# EAGLE design lm3410-sepic-led-driver-16mm-mk-4 (EAGLE 6.5.0)
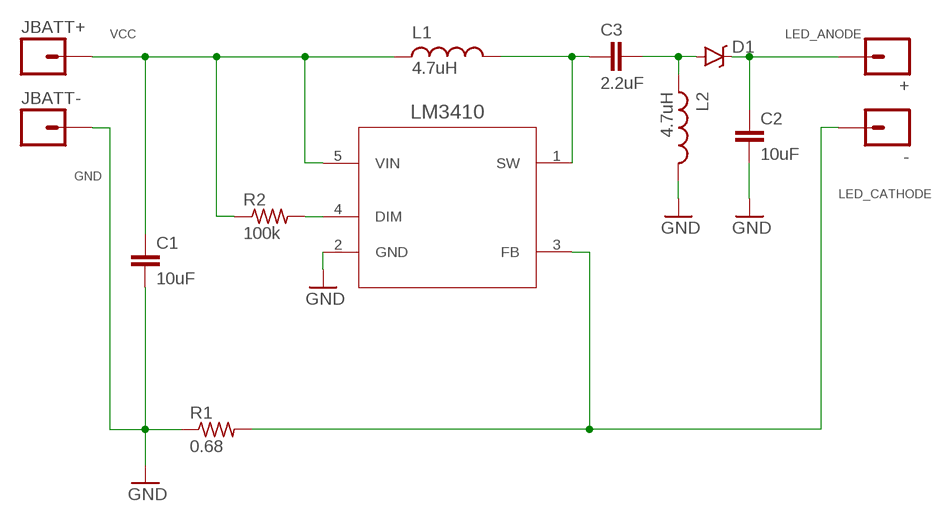
[diagram p0: schematic, sheet 1]

## Parts
+  M01PTH-1.2MM  [1X01-1.2MM]
-  M01PTH-1.2MM-NS  [1X01-1.2MM-NS]
C1  10uF  CAPACITOR-CERAMICC0603  [C0603]
C2  10uF  CAPACITOR-CERAMICC0603  [C0603]
C3  2.2uF  CAPACITOR-CERAMICC0805  [C0805]
D1  MBRA140  DIODE-SCHOTTKYMBRA140  [SMA-DIODE]
JBATT+  M01NOT-A-VIA-NOPE  [1X01_NOSILK_NOSTOP]
JBATT-  M01NOT-A-VIA-NOPE  [1X01_NOSILK_NOSTOP]
L1  4.7uH  INDUCTORTAIYO-YUDEN-30XX  [TAIYO-YUDEN-30XX]
L2  4.7uH  INDUCTORTAIYO-YUDEN-30XX  [TAIYO-YUDEN-30XX]
LM3410  LM3410XMF  [SOT95P285X120-5N]
R1  0.68  RESISTORR1206  [R1206]
R2  100k  RESISTORR0603  [R0603]

## Nets
GND: C1.2 C2.2 JBATT-.P$1 L2.2 LM3410.2(GND) R1.1
LED_ANODE: +.P$1 C2.1 D1.C
LED_CATHODE: -.P$1 LM3410.3(FB) R1.2
N$1: C3.2 D1.A L2.1
N$3: LM3410.4(DIM) R2.2
SW: C3.1 L1.2 LM3410.1(SW)
VCC: C1.1 JBATT+.P$1 L1.1 LM3410.5(VIN) R2.1

## Library data of the parts
+ - JBATT+ JBATT- = A_butts:M01: Header 1 Standard 1-pin 0.1" header. Use with straight break away headers (SKU : PRT-00116), right angle break away headers (PRT-00553), swiss pins (PRT-00743), machine pins (PRT-00117), and female headers (PRT-00115).
C1-C3 = A_butts:CAPACITOR-CERAMIC: CAPACITOR, European symbol
D1 = A_butts:DIODE-SCHOTTKY: Schottky diodes in SFE's production catalog BAT20J 1A 23V 0.62Vf RB751 120mA 40V 0.37Vf PMEG4005EJ 0.5A 40V 0.42Vf MBRA140 1A 40V 0.5Vf B340A 3A 40V SMA; PROD_ID: DIO-08053
L1 L2 = A_butts:INDUCTOR: Inductors Basic Inductor/Choke - 0603 and 1206. Footprints are not proven and vary greatly between part numbers. SRN6045- 33uH, 20% 1.4A SDR0403-560KL - 56uH, 10%, 500mA RMS/740mA peak
LM3410 = A_butts:LM3410XMF: Constant Current Boost and SEPIC LED Driver; MPN: LM3410XMF; OC_FARNELL: 1685357; OC_NEWARK: 75M6032; PACKAGE: SOT-5; SUPPLIER: National Semiconductor
R1 R2 = A_butts:RESISTOR: RESISTOR, American symbol

## Board
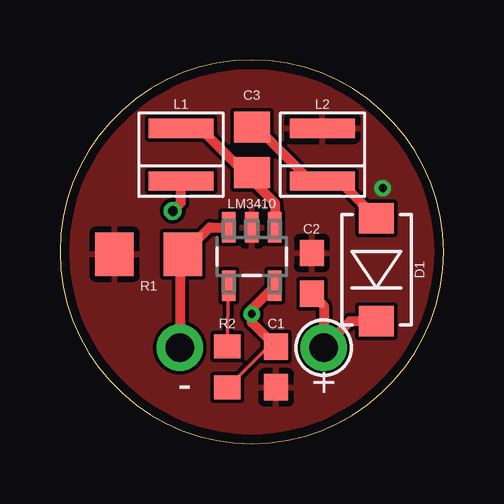
[diagram p1: board, top side]
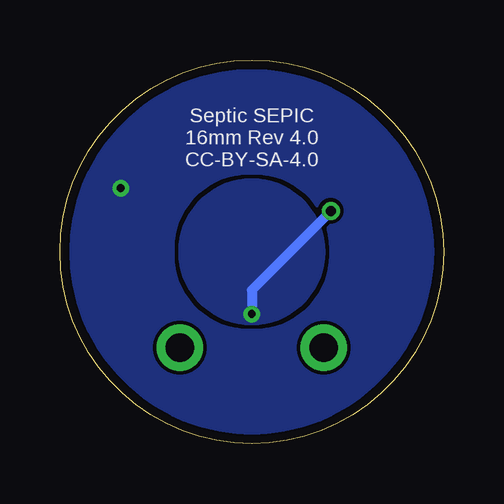
[diagram p2: board, bottom side, seen from below]

Size 16 x 16 mm. Coordinates in mm from the lower left corner, seen from the top.
Outline: 0,8 arc90 8,0 arc90 16,8 arc90 8,16 arc90 0,8
Copper layers (1*16): Top 0.0356mm / dielectric 1.5011mm / Bottom 0.0356mm
Design rules "LaenPCBOrder2": minimum track width 6mil, minimum drill 13mil, track to track 6mil, track to pad 6mil, pad to pad 6mil, via to via 6mil, smd to smd 6mil, copper to edge 15mil, drill to drill 6mil, minimum pad ring 7mil, minimum via ring 7mil, stop-mask expansion 3mil, vias tented up to drill 20mil, thermal gap 10mil

### Footprints (pad centres in the part's own frame; a part is rotated, then mirrored left to right if it is on the bottom)
1X01-1.2MM = drill 1.2 pad 1.93: P$1 0,0
1X01-1.2MM-NS = drill 1.2 pad 1.93: P$1 0,0
C0603 = smd 1.1 x 1: 1 -0.85,0; 2 0.85,0
C0805 = smd 1.3 x 1.5: 1 -0.95,0; 2 0.95,0
SMA-DIODE = smd 1.27 x 1.47: A -2.15,0; C 2.15,0
1X01_NOSILK_NOSTOP = drill 0.33: P$1 0,0
TAIYO-YUDEN-30XX = smd 0.8 x 2.7: 1 0,0; 2 2.2,0
SOT95P285X120-5N = smd 1.27 x 0.559: 1 -1.219,0.965; 2 -1.219,0; 3 -1.219,-0.965; 4 1.219,-0.965; 5 1.219,0.965
R1206 = smd 1.6 x 1.803: 1 -1.422,0; 2 1.422,0
R0603 = smd 1 x 1.1: 1 -0.85,0; 2 0.85,0

### Placement (x,y rotation side)
+  11,4 90 top
-  5,4 0 top
C1  9.02,3.2 270 top
C2  10.5,7.1 90 top
C3  8,12.25 90 top
D1  13.2,7.25 270 top
JBATT+  8,5.4 0 top
JBATT-  13.46,10.65 0 top
L1  5.05,10.95 90 top
L2  10.95,10.95 90 top
LM3410  8,7.8 270 top
R1  3.7,7.9 0 top
R2  6.98,3.2 90 top

### Tracks (layer width: path | path; a pad name or v marks a point on that pad's centre or on a via)
GND
  pour Bottom (rank 6): 8,0 arc-90 0,8 arc-90 8,16 arc-90 16,8 arc-90
  pour Top (rank 6): 8,0 arc-90 0,8 arc-90 8,16 arc-90 16,8 arc-90
LED_ANODE
  Top 0.406: C2.1 11,5.75 +.P$1 12.1,5.1 D1.C
LED_CATHODE
  Top 0.406: LM3410.3 6.24,9.02 R1.2 5,7.78 -.P$1
N$1
  Top 0.406: C3.2 8.2,13.2 10.3,11.1 11.5,11.1 11.55,11.05 | 11.55,11.05 D1.A | L2.1 11.45,10.95 11.55,11.05
N$3
  Top 0.152: 7,6.55 R2.2
  Top 0.254: LM3410.4 7,6.55
SW
  Top 0.406: C3.1 8,11 | 8,11 8.2,10.8 8.96,10.04 LM3410.1 | L1.2 5.85,13.15 8,11
VCC  (via drill 0.4)
  Top 0.152: R2.1 8.7,4.05 C1.1
  Top 0.406: v4.7,9.7 5.05,10.05 L1.1 | LM3410.5 8,5.62 JBATT+.P$1 8,5.05 C1.1
  Bottom 0.406: v4.7,9.7 8,6.4 JBATT+.P$1
  pour Bottom: 5,8 arc90 8,5 arc90 11,8 arc90 8,11 arc90

### Text on the board
bPlace: Septic SEPIC / 16mm Rev 4.0 / CC-BY-SA-4.0